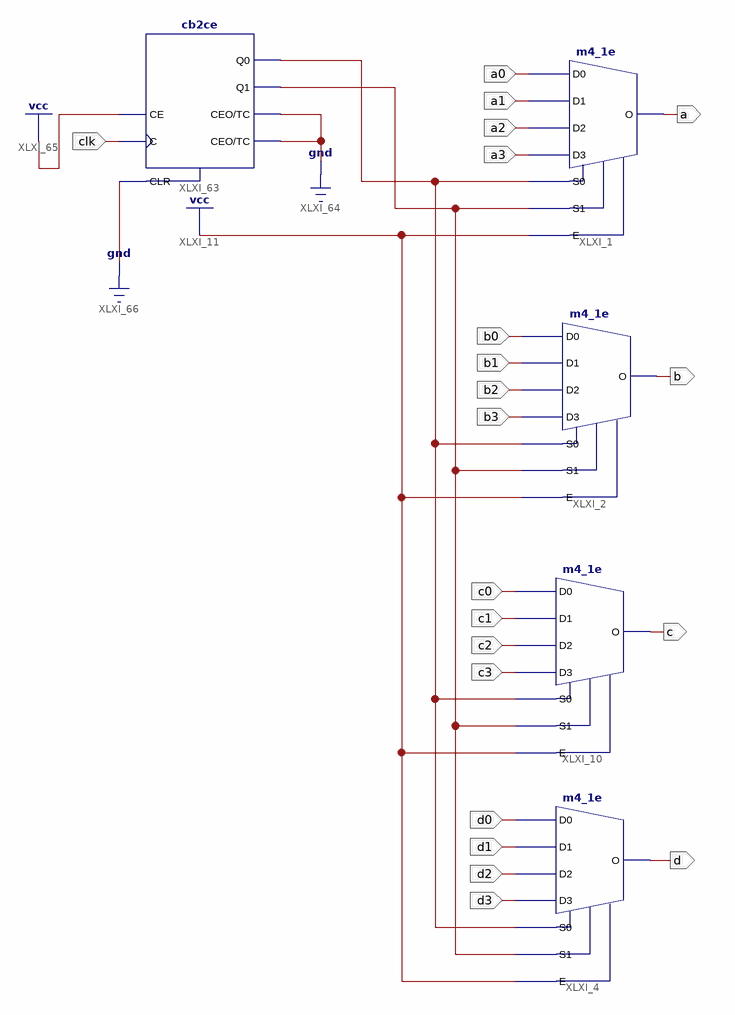
[diagram p0: schematic sheet 1]
// Xilinx ISE schematic muxx.sch (spartan6) as structural Verilog: 5 symbols, 21 ports
module muxx (
  input  a0,
  input  a1,
  input  a2,
  input  a3,
  input  b0,
  input  b1,
  input  b2,
  input  b3,
  input  c0,
  input  c1,
  input  c2,
  input  c3,
  input  d0,
  input  d1,
  input  d2,
  input  d3,
  input  clk,
  output c,
  output b,
  output d,
  output a
);

  wire S0, S1;

  m4_1e XLXI_1 (.D0(a0), .D1(a1), .D2(a2), .D3(a3), .E(1'b1), .S0(S0), .S1(S1), .O(a));
  m4_1e XLXI_2 (.D0(b0), .D1(b1), .D2(b2), .D3(b3), .E(1'b1), .S0(S0), .S1(S1), .O(b));
  m4_1e XLXI_10 (.D0(c0), .D1(c1), .D2(c2), .D3(c3), .E(1'b1), .S0(S0), .S1(S1), .O(c));
  m4_1e XLXI_4 (.D0(d0), .D1(d1), .D2(d2), .D3(d3), .E(1'b1), .S0(S0), .S1(S1), .O(d));
  cb2ce XLXI_63 (.C(clk), .CE(1'b1), .CLR(1'b0), .CEO(1'b0), .Q0(S0), .Q1(S1), .TC(1'b0));
endmodule
